# EAGLE design Imperial_March (EAGLE 5.11)
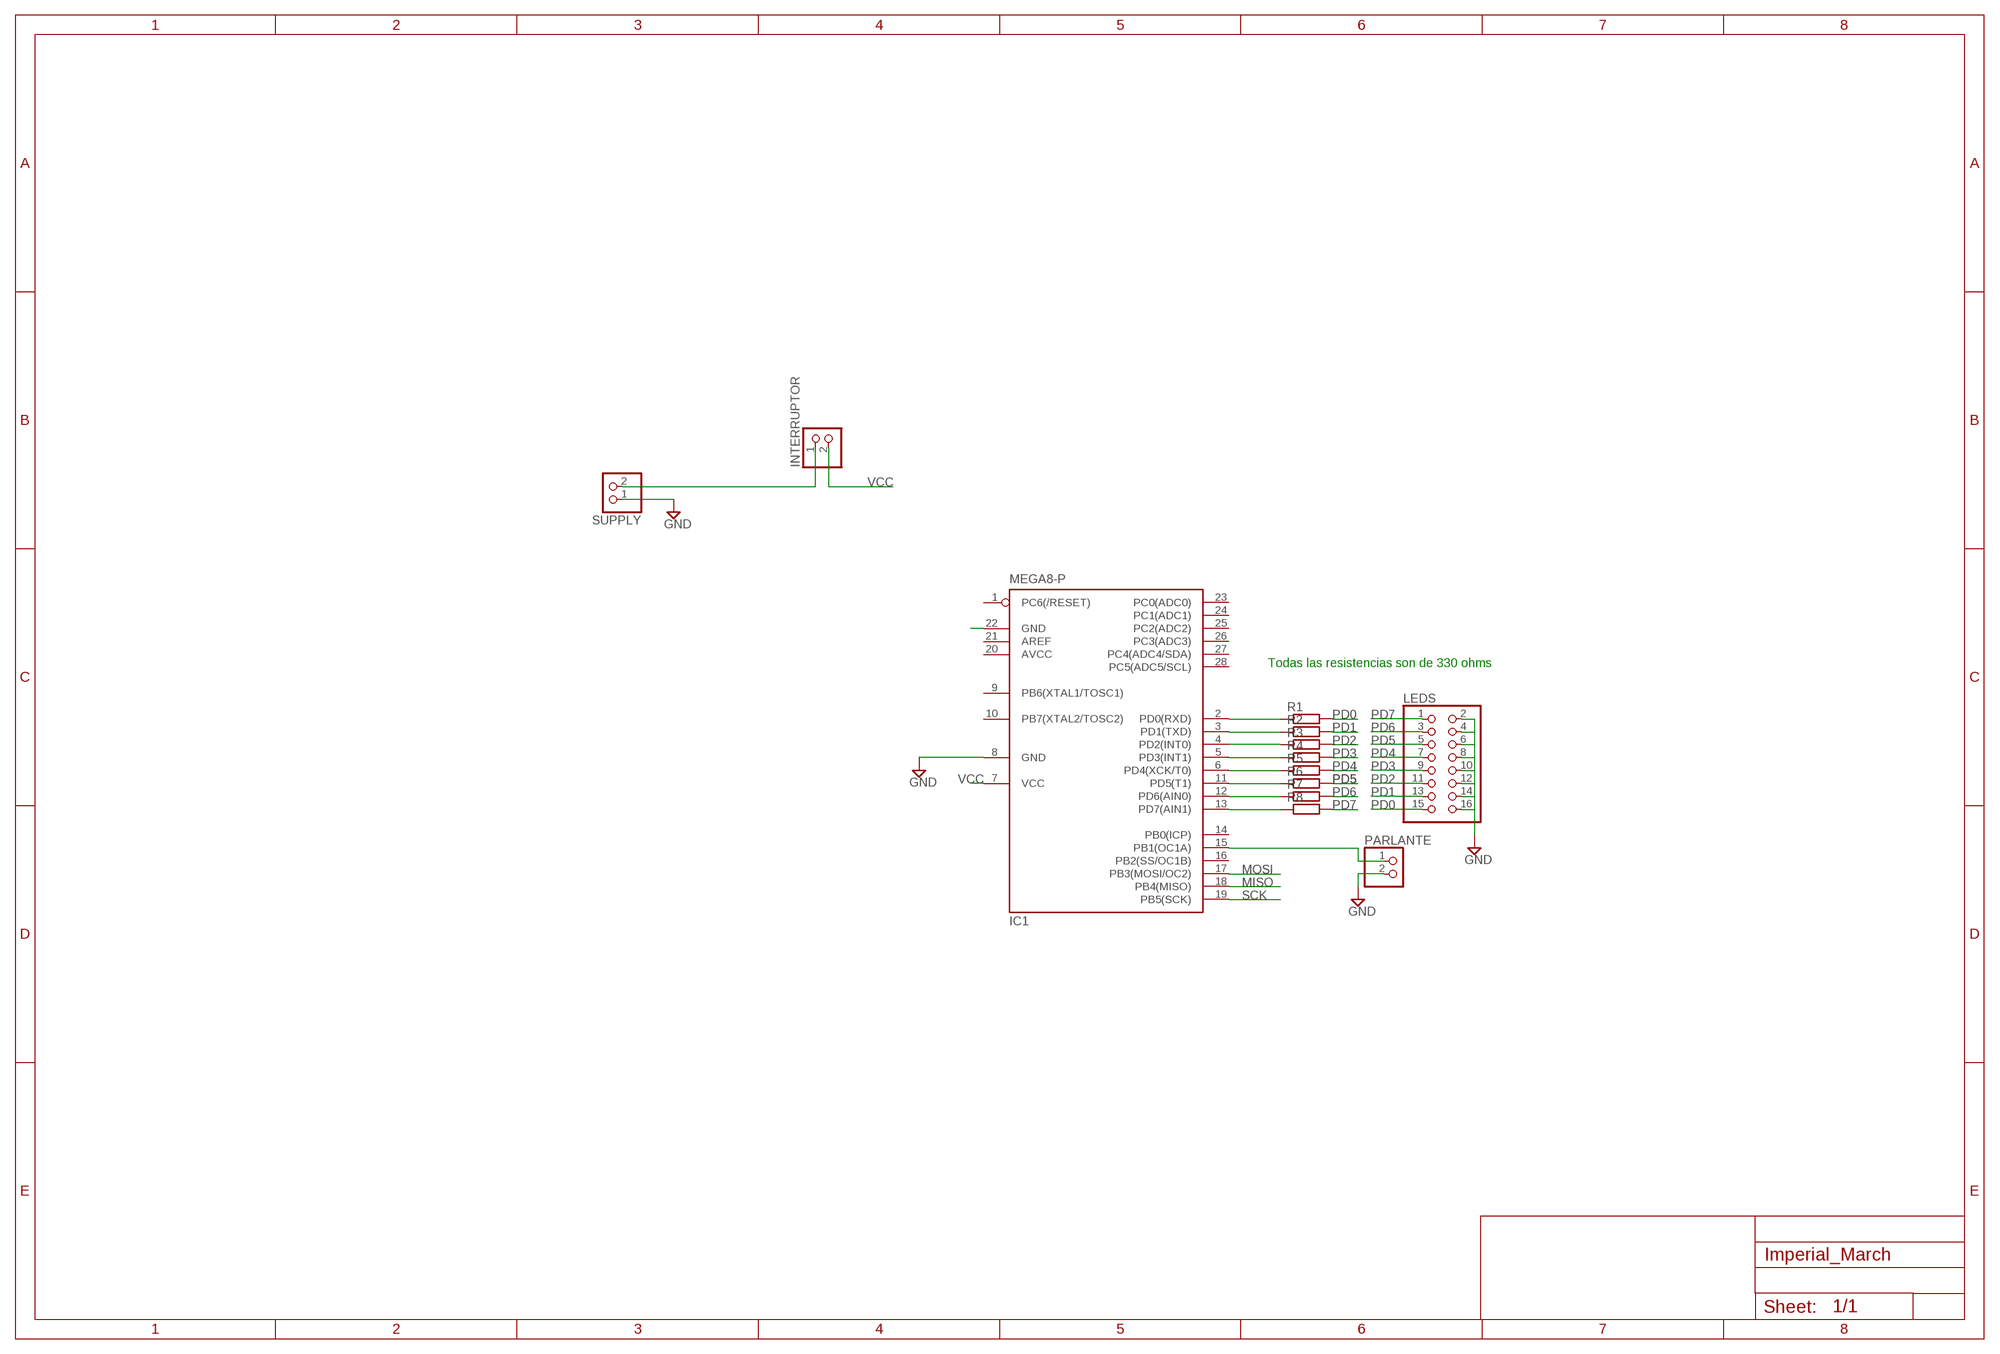
[diagram p0: schematic, sheet 1]

## Parts
IC1  MEGA8-P  [DIL28-3]
INTERRUPTOR  PINHD-1X2  [1X02]
LEDS  PINHD-2X8  [2X08]
PARLANTE  PINHD-1X2  [1X02]
R1  R-EU_0207/10  [0207/10]
R2  R-EU_0207/10  [0207/10]
R3  R-EU_0207/10  [0207/10]
R4  R-EU_0207/10  [0207/10]
R5  R-EU_0207/10  [0207/10]
R6  R-EU_0207/10  [0207/10]
R7  R-EU_0207/10  [0207/10]
R8  R-EU_0207/10  [0207/10]
SUPPLY  PINHD-1X2  [1X02]

## Nets
GND: IC1.8(GND) LEDS.2 LEDS.4 LEDS.6 LEDS.8 LEDS.10 LEDS.12 LEDS.14 LEDS.16 PARLANTE.2 SUPPLY.1
MISO: IC1.18(PB4(MISO))
MOSI: IC1.17(PB3(MOSI/OC2))
N$1: IC1.2(PD0(RXD)) R1.1
N$2: IC1.3(PD1(TXD)) R2.1
N$3: INTERRUPTOR.1 SUPPLY.2
N$4: IC1.4(PD2(INT0)) R3.1
N$5: IC1.5(PD3(INT1)) R4.1
N$6: IC1.6(PD4(XCK/T0)) R5.1
N$7: IC1.11(PD5(T1)) R6.1
N$8: IC1.12(PD6(AIN0)) R7.1
N$9: IC1.13(PD7(AIN1)) R8.1
N$10: IC1.15(PB1(OC1A)) PARLANTE.1
N$11: IC1.22(GND)
PD0: LEDS.15 R1.2
PD1: LEDS.13 R2.2
PD2: LEDS.11 R3.2
PD3: LEDS.9 R4.2
PD4: LEDS.7 R5.2
PD5: LEDS.5 R6.2
PD6: LEDS.3 R7.2
PD7: LEDS.1 R8.2
SCK: IC1.19(PB5(SCK))
VCC: IC1.7(VCC) INTERRUPTOR.2
Unconnected: IC1.1(PC6(/RESET)) IC1.9(PB6(XTAL1/TOSC1)) IC1.10(PB7(XTAL2/TOSC2)) IC1.14(PB0(ICP)) IC1.16(PB2(SS/OC1B)) IC1.21(AREF) IC1.23(PC0(ADC0)) IC1.24(PC1(ADC1)) IC1.25(PC2(ADC2)) IC1.26(PC3(ADC3)) IC1.27(PC4(ADC4/SDA)) IC1.28(PC5(ADC5/SCL))

## Notes on the sheet
- Todas las resistencias son de 330 ohms

## Power pins joined to a net without a drawn wire
AVCC: IC1.20(AVCC)

## Library data of the parts
IC1 = atmel:MEGA8-P: MICROCONTROLLER 8 Kbytes FLASH, 1 kbytes SRAM, 512 bytes EEPROM, USART, 4-channel 10 bit ADC, 2-channel 8 bit ADC Pin compatible with Atmega48, ATMega88, ATMega168 Source: avr.lbr; OC_FARNELL: unknown; OC_NEWARK: unknown
INTERRUPTOR PARLANTE SUPPLY = pinhead:PINHD-1X2: PIN HEADER
LEDS = pinhead:PINHD-2X8: PIN HEADER
R1-R8 = rcl:R-EU_: RESISTOR, European symbol

## Board
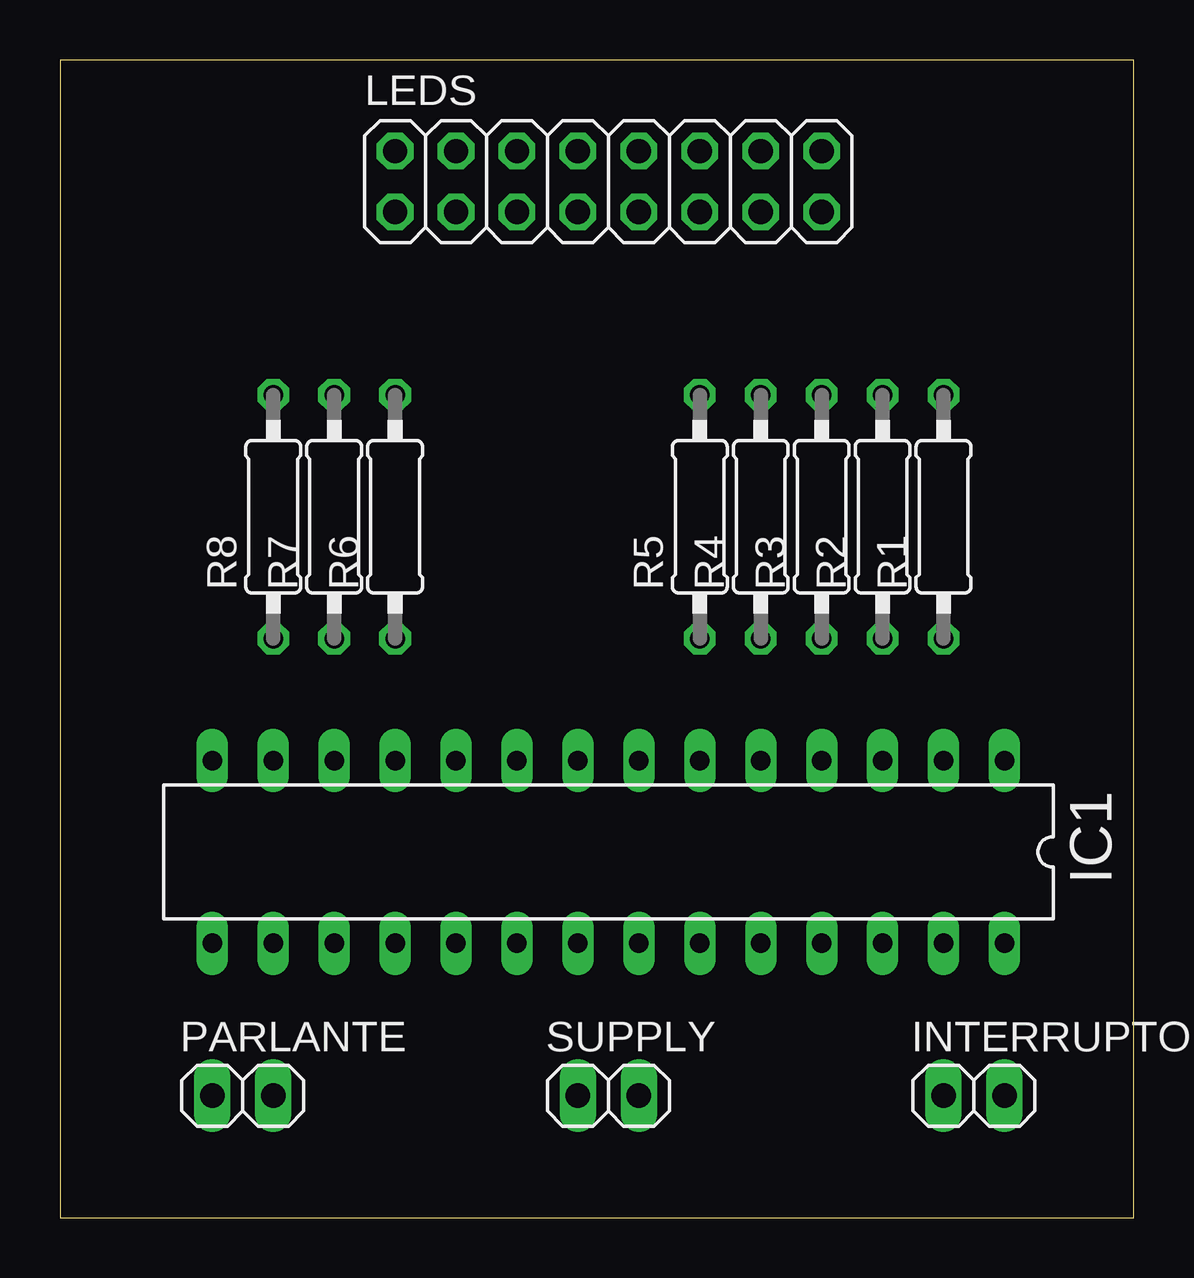
[diagram p1: board, top side]
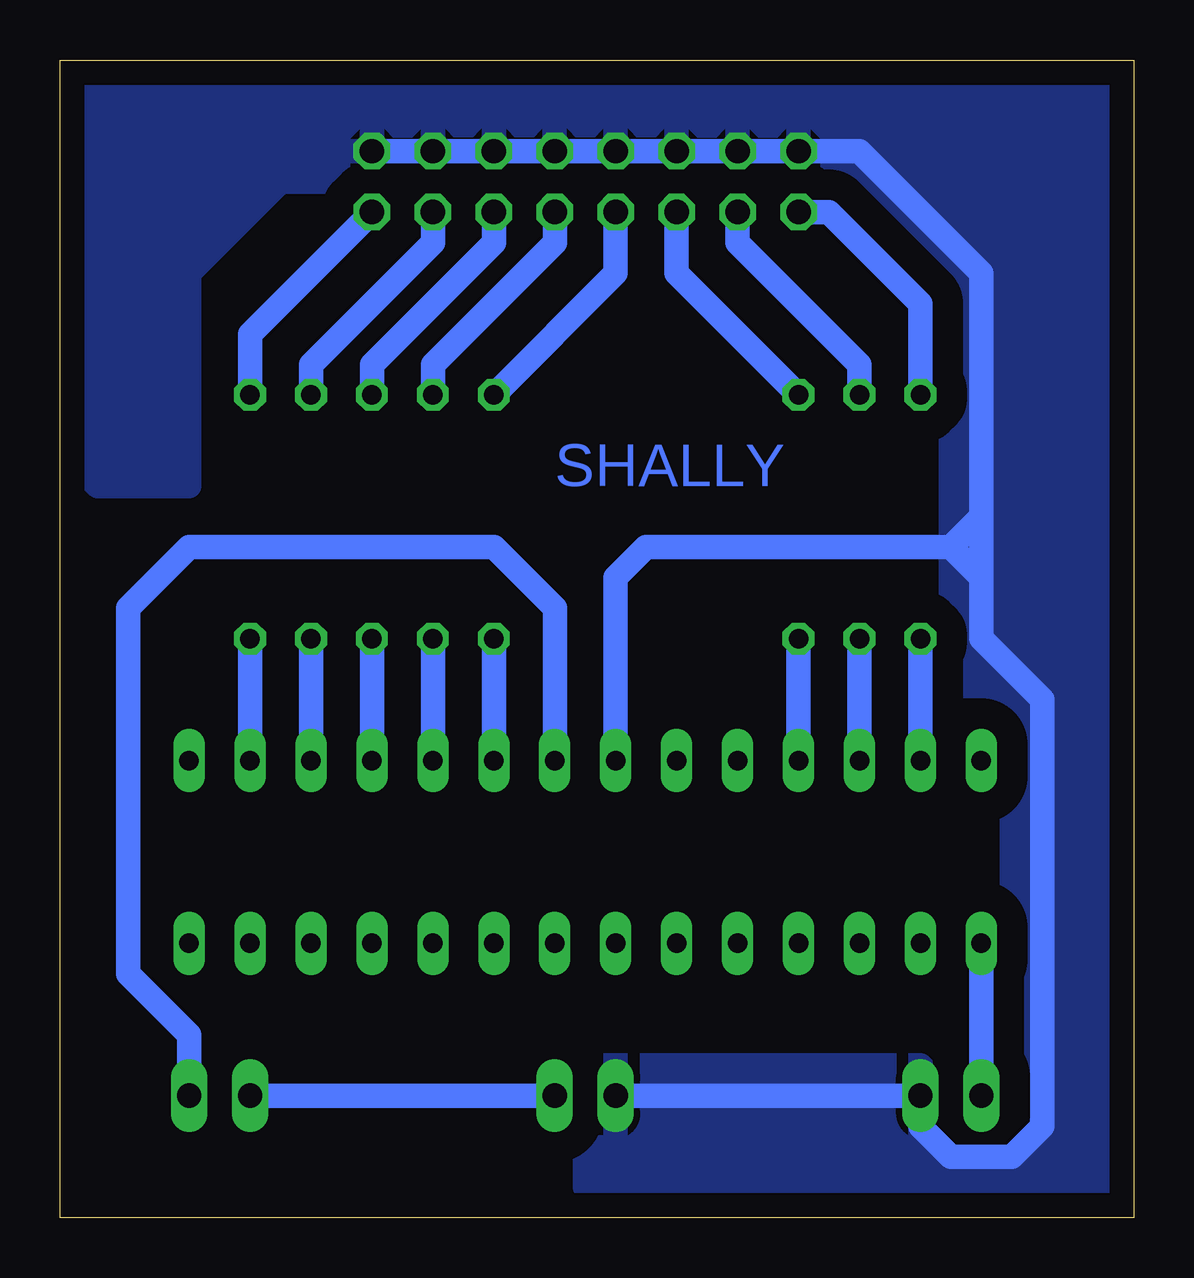
[diagram p2: board, bottom side, seen from below]

Size 44.75 x 48.25 mm. Coordinates in mm from the lower left corner, seen from the top.
Outline: 0,0 44.75,0 44.75,48.25 0,48.25 0,0
Copper layers (1*16): Top 0.035mm / dielectric 1.5mm / Bottom 0.035mm
Design rules "default *": minimum track width 10mil, minimum drill 24mil, track to track 50mil, track to pad 50mil, pad to pad 8mil, via to via 8mil, smd to smd 8mil, copper to edge 40mil, drill to drill 8mil, minimum pad ring 10mil, minimum via ring 8mil, stop-mask expansion 4mil, vias tented up to drill 0mil, thermal gap 10mil

### Footprints (pad centres in the part's own frame; a part is rotated, then mirrored left to right if it is on the bottom)
DIL28-3 = drill 0.813 long: 1 -16.51,-3.81; 2 -13.97,-3.81; 3 -11.43,-3.81; 4 -8.89,-3.81; 5 -6.35,-3.81; 6 -3.81,-3.81; 7 -1.27,-3.81; 8 1.27,-3.81; 9 3.81,-3.81; 10 6.35,-3.81; 11 8.89,-3.81; 12 11.43,-3.81; 13 13.97,-3.81; 14 16.51,-3.81; 15 16.51,3.81; 16 13.97,3.81; 17 11.43,3.81; 18 8.89,3.81; 19 6.35,3.81; 20 3.81,3.81; 21 1.27,3.81; 22 -1.27,3.81; 23 -3.81,3.81; 24 -6.35,3.81; 25 -8.89,3.81; 26 -11.43,3.81; 27 -13.97,3.81; 28 -16.51,3.81
1X02 = drill 1.016 long: 1 -1.27,0; 2 1.27,0
2X08 = drill 1.016 octagon: 1 -8.89,-1.27; 2 -8.89,1.27; 3 -6.35,-1.27; 4 -6.35,1.27; 5 -3.81,-1.27; 6 -3.81,1.27; 7 -1.27,-1.27; 8 -1.27,1.27; 9 1.27,-1.27; 10 1.27,1.27; 11 3.81,-1.27; 12 3.81,1.27; 13 6.35,-1.27; 14 6.35,1.27; 15 8.89,-1.27; 16 8.89,1.27
0207/10 = drill 0.813 octagon: 1 -5.08,0; 2 5.08,0

### Placement (x,y rotation side)
IC1  22.86,15.24 180 top
INTERRUPTOR  38.1,5.08 0 top
LEDS  22.86,43.18 0 top
PARLANTE  7.62,5.08 0 top
R1  36.83,29.21 90 top
R2  34.29,29.21 90 top
R3  31.75,29.21 90 top
R4  29.21,29.21 90 top
R5  26.67,29.21 90 top
R6  13.97,29.21 90 top
R7  11.43,29.21 90 top
R8  8.89,29.21 90 top
SUPPLY  22.86,5.08 0 top

### Tracks (layer width: path | path; a pad name or v marks a point on that pad's centre or on a via)
GND
  Bottom 1.016: LEDS.16 LEDS.14 LEDS.12 LEDS.10 LEDS.8 LEDS.6 LEDS.4 LEDS.2 11.43,44.45 6.35,39.37 6.35,29.21 | SUPPLY.1 PARLANTE.2 8.89,3.81 7.62,2.54 5.08,2.54 3.81,3.81 3.81,21.59 6.35,24.13 6.35,29.21 | IC1.8 21.59,26.67 20.32,27.94 7.62,27.94 | 6.35,29.21 7.62,27.94 | 7.62,27.94 6.35,26.67
  pour Bottom: 39.37,30.48 43.18,30.48 44.45,31.75 44.45,46.99 43.18,48.26 1.27,48.26 0,46.99 0,1.27 1.27,0 21.59,0 22.86,1.27 22.86,6.35 8.89,6.35 7.62,5.08 5.08,7.62 5.08,20.32 7.62,22.86 7.62,39.37 11.43,43.18 35.56,43.18 39.37,39.37
N$1
  Bottom 1.016: IC1.2 R1.1
N$2
  Bottom 1.016: IC1.3 R2.1
N$3
  Bottom 1.016: SUPPLY.2 INTERRUPTOR.1
N$4
  Bottom 1.016: IC1.4 R3.1
N$5
  Bottom 1.016: IC1.5 R4.1
N$6
  Bottom 1.016: IC1.6 R5.1
N$7
  Bottom 1.016: IC1.11 R6.1
N$8
  Bottom 1.016: IC1.12 R7.1
N$9
  Bottom 1.016: IC1.13 R8.1
N$10
  Bottom 1.016: PARLANTE.1 IC1.15
PD0
  Bottom 1.016: LEDS.15 36.83,36.83 R1.2
PD1
  Bottom 1.016: LEDS.13 29.21,40.64 34.29,35.56 R2.2
PD2
  Bottom 1.016: LEDS.11 26.67,40.64 31.75,35.56 R3.2
PD3
  Bottom 1.016: LEDS.9 24.13,40.64 29.21,35.56 R4.2
PD4
  Bottom 1.016: R5.2 21.59,39.37 LEDS.7
PD5
  Bottom 1.016: R6.2 19.05,39.37 LEDS.5
PD6
  Bottom 1.016: LEDS.3 16.51,40.64 11.43,35.56 R7.2
PD7
  Bottom 1.016: LEDS.1 12.7,41.91 8.89,38.1 R8.2
VCC
  Bottom 1.016: INTERRUPTOR.2 39.37,7.62 41.91,10.16 41.91,25.4 39.37,27.94 26.67,27.94 24.13,25.4 IC1.7

### Text on the board
Bottom: SHALLY